# Altium schematic sheet BatteryBoxLeft.SchDoc
size A1
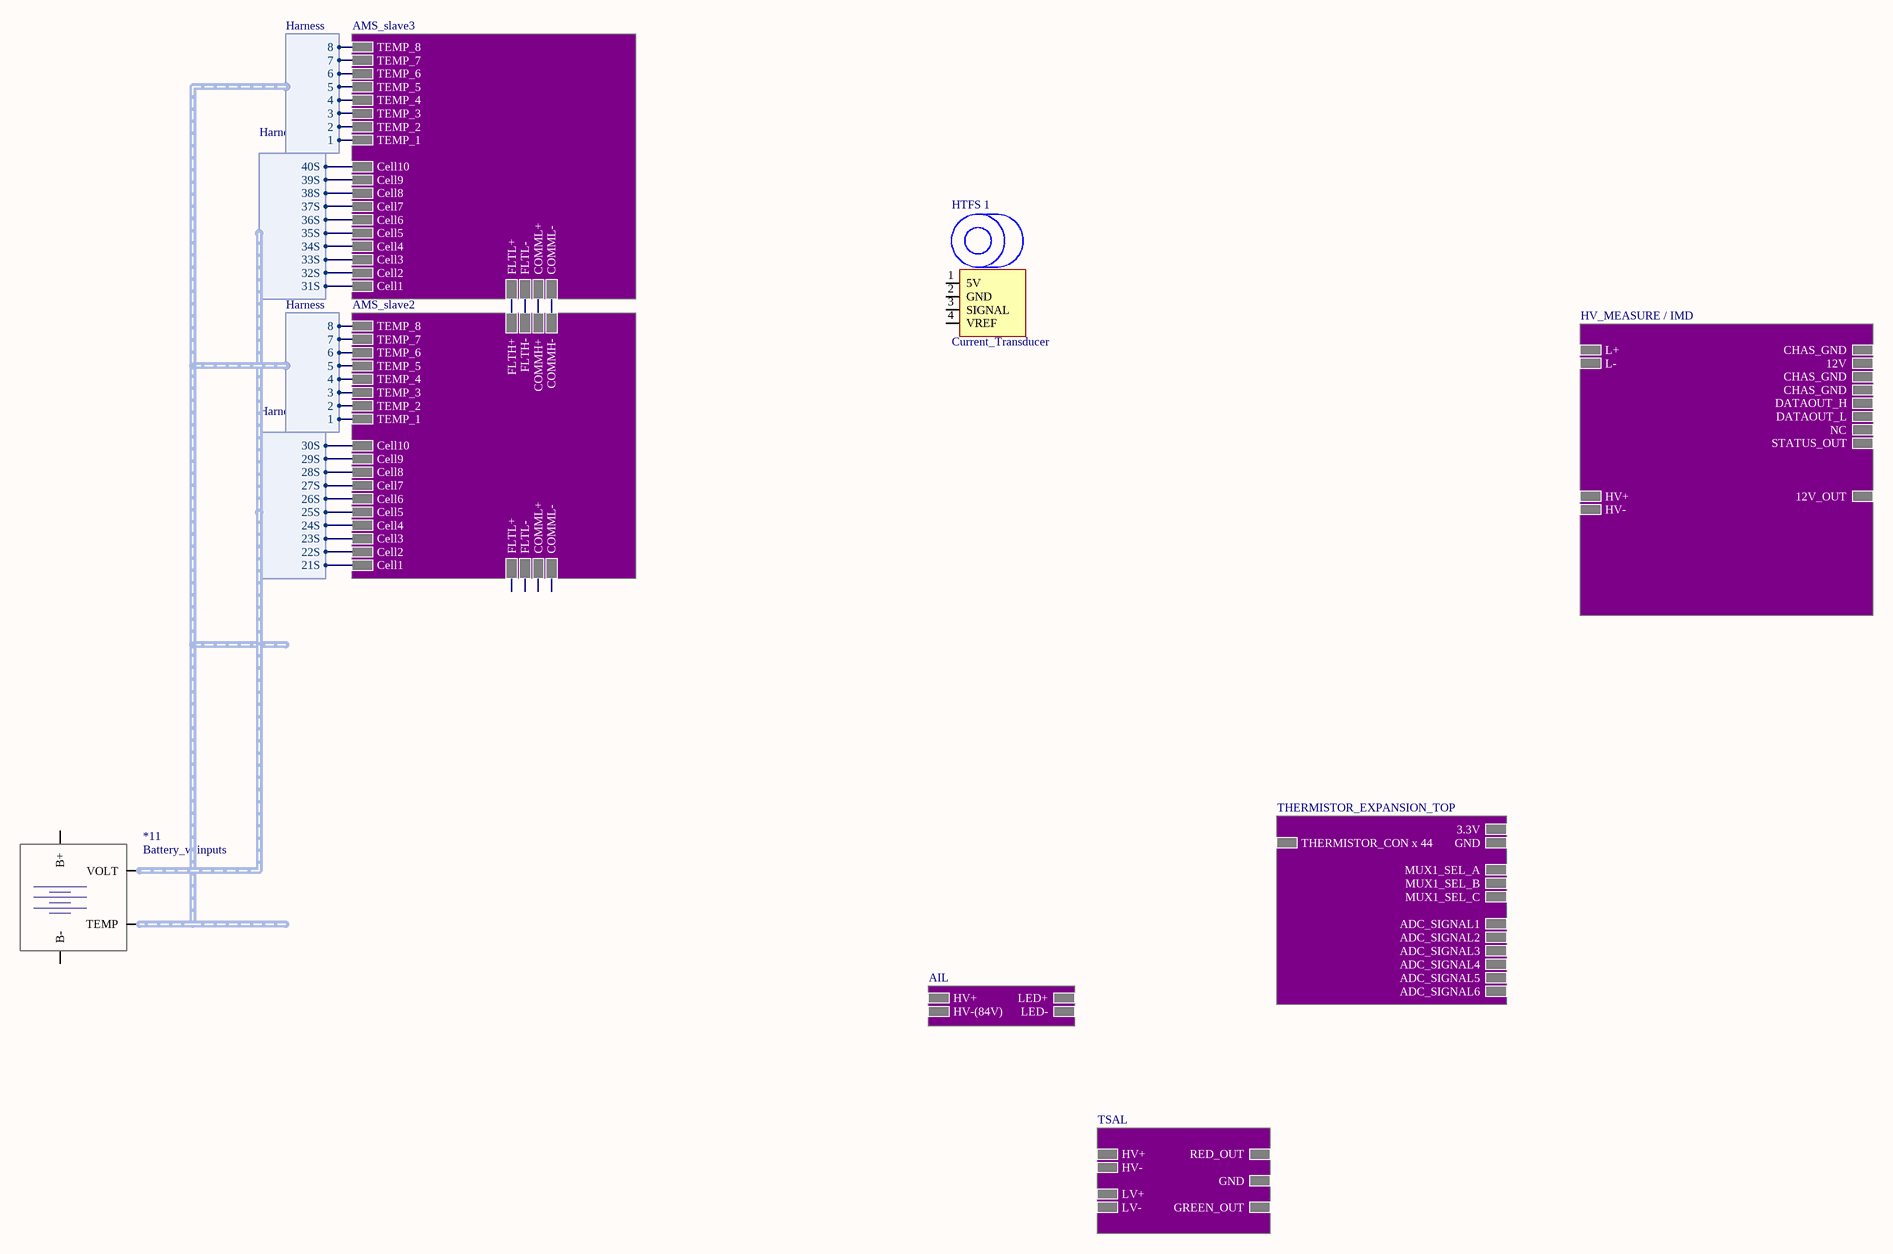
[diagram p0: BatteryBoxLeft.SchDoc]

## Parts
*11  Battery_w/inputs
HTFS_1  Current_Transducer

## Sub-sheets
AIL = ?: HV+, HV-(84V), LED+, LED-
AMS_slave2 = ?: Cell10, Cell9, Cell8, Cell7, Cell6, Cell5, Cell4, Cell3, Cell2, Cell1, FLTH+, FLTH-, COMMH+, COMMH-, FLTL+, FLTL-, COMML+, COMML-, TEMP_1, TEMP_3, TEMP_4, TEMP_5, TEMP_6, TEMP_7, TEMP_8, TEMP_2
AMS_slave3 = ?: Cell10, Cell9, Cell8, Cell7, Cell6, Cell5, Cell4, Cell3, Cell2, Cell1, FLTL+, FLTL-, COMML+, COMML-, TEMP_1, TEMP_3, TEMP_4, TEMP_5, TEMP_6, TEMP_7, TEMP_8, TEMP_2
HV_MEASURE / IMD = ?: L+, L-, CHAS_GND, 12V, CHAS_GND, CHAS_GND, DATAOUT_H, DATAOUT_L, NC, STATUS_OUT, HV+, HV-, 12V_OUT
THERMISTOR_EXPANSION_TOP = ?: 3.3V, GND, MUX1_SEL_A, MUX1_SEL_B, MUX1_SEL_C, ADC_SIGNAL2, ADC_SIGNAL3, ADC_SIGNAL4, THERMISTOR_CON x 44, ADC_SIGNAL1, ADC_SIGNAL5, ADC_SIGNAL6
TSAL = ?: HV+, HV-, LV+, LV-, RED_OUT, GND, GREEN_OUT

## Harnesses
Harness: 30S, 29S, 28S, 27S, 26S, 25S, 24S, 23S, 22S, 21S
Harness: 40S, 39S, 38S, 37S, 36S, 35S, 34S, 33S, 32S, 31S
Harness: 1, 2, 3, 4, 5, 6, 7, 8

## Nets
(unnamed): sheet AMS_slave2/Cell10, harness Harness.30S
(unnamed): sheet AMS_slave2/Cell9, harness Harness.29S
(unnamed): sheet AMS_slave2/Cell8, harness Harness.28S
(unnamed): sheet AMS_slave2/Cell7, harness Harness.27S
(unnamed): sheet AMS_slave2/Cell6, harness Harness.26S
(unnamed): sheet AMS_slave2/Cell5, harness Harness.25S
(unnamed): sheet AMS_slave2/Cell4, harness Harness.24S
(unnamed): sheet AMS_slave2/Cell3, harness Harness.23S
(unnamed): sheet AMS_slave2/Cell2, harness Harness.22S
(unnamed): sheet AMS_slave2/Cell1, harness Harness.21S
(unnamed): sheet AMS_slave2/FLTH+, sheet AMS_slave3/FLTL+
(unnamed): sheet AMS_slave2/FLTH-, sheet AMS_slave3/FLTL-
(unnamed): sheet AMS_slave2/COMMH+, sheet AMS_slave3/COMML+
(unnamed): sheet AMS_slave2/COMMH-, sheet AMS_slave3/COMML-
(unnamed): sheet AMS_slave2/TEMP_1, sheet AMS_slave3/TEMP_1, harness Harness.1
(unnamed): sheet AMS_slave2/TEMP_3, sheet AMS_slave3/TEMP_3, harness Harness.3
(unnamed): sheet AMS_slave2/TEMP_4, sheet AMS_slave3/TEMP_4, harness Harness.4
(unnamed): sheet AMS_slave2/TEMP_5, sheet AMS_slave3/TEMP_5, harness Harness.5
(unnamed): sheet AMS_slave2/TEMP_6, sheet AMS_slave3/TEMP_6, harness Harness.6
(unnamed): sheet AMS_slave2/TEMP_7, sheet AMS_slave3/TEMP_7, harness Harness.7
(unnamed): sheet AMS_slave2/TEMP_8, sheet AMS_slave3/TEMP_8, harness Harness.8
(unnamed): sheet AMS_slave2/TEMP_2, sheet AMS_slave3/TEMP_2, harness Harness.2
(unnamed): sheet AMS_slave3/Cell10, harness Harness.40S
(unnamed): sheet AMS_slave3/Cell9, harness Harness.39S
(unnamed): sheet AMS_slave3/Cell8, harness Harness.38S
(unnamed): sheet AMS_slave3/Cell7, harness Harness.37S
(unnamed): sheet AMS_slave3/Cell6, harness Harness.36S
(unnamed): sheet AMS_slave3/Cell5, harness Harness.35S
(unnamed): sheet AMS_slave3/Cell4, harness Harness.34S
(unnamed): sheet AMS_slave3/Cell3, harness Harness.33S
(unnamed): sheet AMS_slave3/Cell2, harness Harness.32S
(unnamed): sheet AMS_slave3/Cell1, harness Harness.31S

Not connected (* = marked no-connect by the designer): *11 1(B+) 2(B-) 3(VOLT) 4(TEMP); HTFS_1 1(5V) 2(GND) 3(SIGNAL) 4(VREF)